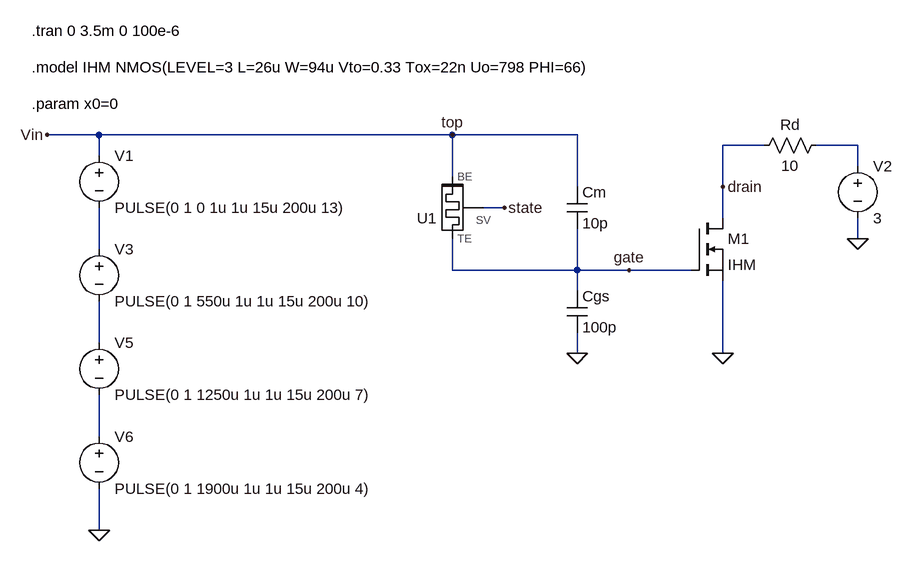
[diagram p0: schematic Neurotransistor_pulse_var.asc]
Neurotransistor_pulse_var.asc, the LTspice schematic file:
Version 4
SHEET 1 1728 2052
WIRE -80 256 -160 256
WIRE 464 256 -80 256
WIRE 656 256 464 256
WIRE 944 272 880 272
WIRE 1088 272 1024 272
WIRE -80 288 -80 256
WIRE 1088 304 1088 272
WIRE 464 320 464 256
WIRE 656 336 656 256
WIRE 880 336 880 272
WIRE 544 368 512 368
WIRE 880 384 880 336
WIRE 1088 416 1088 384
WIRE -80 432 -80 368
WIRE 464 464 464 416
WIRE 656 464 656 400
WIRE 656 464 464 464
WIRE 736 464 656 464
WIRE 832 464 736 464
WIRE 656 496 656 464
WIRE -80 576 -80 512
WIRE 656 592 656 560
WIRE 880 592 880 480
WIRE -80 720 -80 656
WIRE -80 864 -80 800
FLAG 544 368 state
FLAG 736 464 gate
FLAG -160 256 Vin
FLAG 464 256 top
FLAG 880 592 0
FLAG 1088 416 0
FLAG 880 336 drain
FLAG -80 864 0
FLAG 656 592 0
SYMBOL voltage -80 272 R0
WINDOW 123 0 0 Left 0
WINDOW 39 0 0 Left 0
SYMATTR InstName V1
SYMATTR Value PULSE(0 1 0 1u 1u 15u 200u 13)
SYMBOL nmos 832 384 R0
SYMATTR InstName M1
SYMATTR Value IHM
SYMBOL res 1040 256 R90
WINDOW 0 0 56 VBottom 2
WINDOW 3 32 56 VTop 2
SYMATTR InstName Rd
SYMATTR Value 10
SYMBOL voltage 1088 288 R0
WINDOW 123 0 0 Left 0
WINDOW 39 0 0 Left 0
SYMATTR InstName V2
SYMATTR Value 3
SYMBOL voltage -80 416 R0
WINDOW 123 0 0 Left 0
WINDOW 39 0 0 Left 0
SYMATTR InstName V3
SYMATTR Value PULSE(0 1 550u 1u 1u 15u 200u 10)
SYMBOL voltage -80 560 R0
WINDOW 123 0 0 Left 0
WINDOW 39 0 0 Left 0
SYMATTR InstName V5
SYMATTR Value PULSE(0 1 1250u 1u 1u 15u 200u 7)
SYMBOL voltage -80 704 R0
WINDOW 123 0 0 Left 0
WINDOW 39 0 0 Left 0
SYMATTR InstName V6
SYMATTR Value PULSE(0 1 1900u 1u 1u 15u 200u 4)
SYMBOL cap 640 496 R0
SYMATTR InstName Cgs
SYMATTR Value 100p
SYMBOL AutoGenerated\\MemAS 480 416 R180
SYMATTR InstName U1
SYMBOL cap 640 336 R0
SYMATTR InstName Cm
SYMATTR Value 10p
TEXT -184 96 Left 2 !.tran 0 3.5m 0 100e-6
TEXT -184 152 Left 2 !.model IHM NMOS(LEVEL=3 L=26u W=94u Vto=0.33 Tox=22n Uo=798 PHI=66)
TEXT -184 208 Left 2 !.param x0=0

The netlist it stands for:
* Neurotransistor_pulse_var.asc
V1 top N002 PULSE(0 1 0 1u 1u 15u 200u 13)
M1 drain gate 0 0 IHM
Rd N001 drain 10
V2 N001 0 3
V3 N002 N003 PULSE(0 1 550u 1u 1u 15u 200u 10)
V5 N003 N004 PULSE(0 1 1250u 1u 1u 15u 200u 7)
V6 N004 0 PULSE(0 1 1900u 1u 1u 15u 200u 4)
Cgs gate 0 100p
XU1 gate top state MemAS  ; pins TE BE SV
Cm top gate 10p
.model NMOS NMOS
.model PMOS PMOS
.lib standard.mos
.tran 0 3.5m 0 100e-6
.model IHM NMOS(LEVEL=3 L=26u W=94u Vto=0.33 Tox=22n Uo=798 PHI=66)
.param x0=0
.lib MemAS.sub
.backanno
.end